# EAGLE design H-bridgeSG3525 (EAGLE 9.6.2)
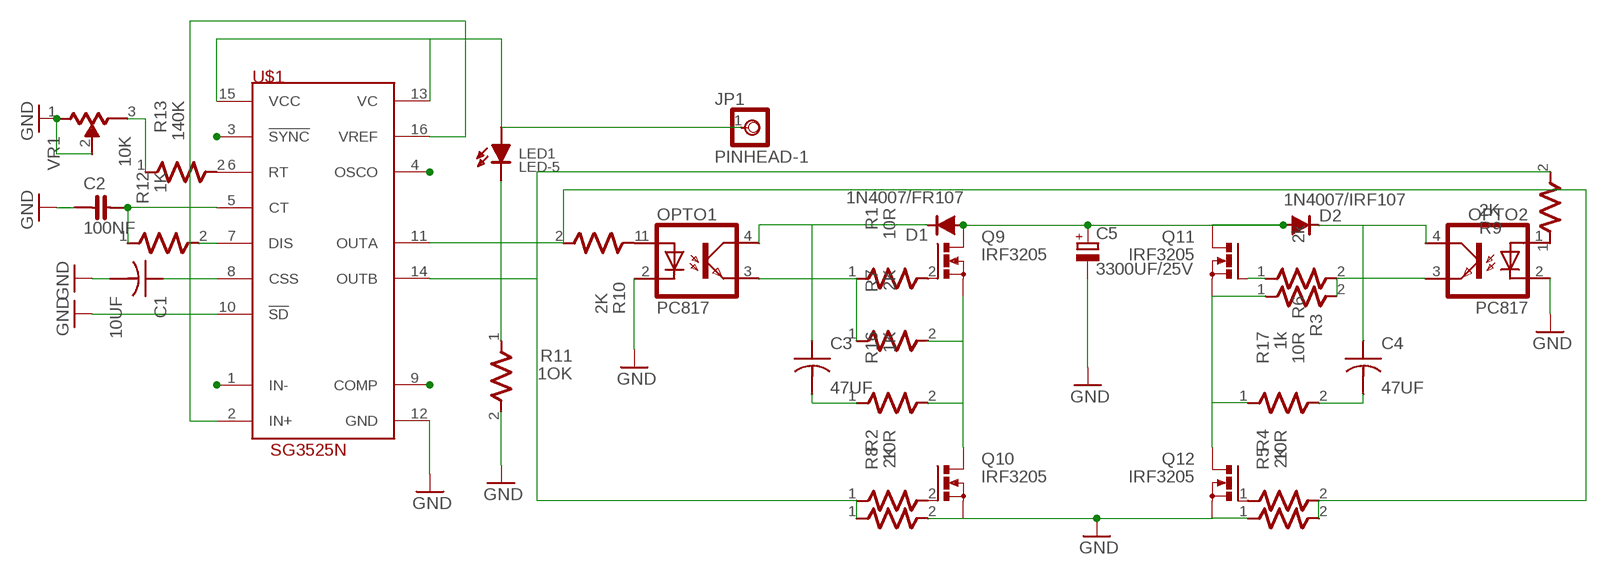
[diagram p0: schematic, sheet 1]

## Parts
C1  10UF  CAP-2,5  [CAP-2,5]
C2  100NF  CAP-NP5  [CAP-NP5]
C3  47UF  CAP-2,5  [CAP-2,5]
C4  47UF  CAP-2,5  [CAP-2,5]
C5  3300UF/25V  CPOL-EUE7.5-18  [E7,5-18]
D1  1N4007/FR107  1N4007  [1N4007]
D2  1N4007/IRF107  1N4007  [1N4007]
JP1  PINHEAD-1  [PINHEAD-1]
LED1  LED-5  [LED5]
OPTO1  PC817  [DIL-04]
OPTO2  PC817  [DIL-04]
Q9  IRF3205  IRF512  [TO220BV]
Q10  IRF3205  IRF512  [TO220BV]
Q11  IRF3205  IRF512  [TO220BV]
Q12  IRF3205  IRF512  [TO220BV]
R1  10R  R-7,5  [R-7,5]
R2  10R  R-7,5  [R-7,5]
R3  10R  R-7,5  [R-7,5]
R4  10R  R-7,5  [R-7,5]
R5  2K  R-7,5  [R-7,5]
R6  2k  R-7,5  [R-7,5]
R7  2K  R-7,5  [R-7,5]
R8  2K  R-7,5  [R-7,5]
R9  2K  R-7,5  [R-7,5]
R10  2K  R-7,5  [R-7,5]
R11  1OK  R-7,5  [R-7,5]
R12  1K  R-7,5  [R-7,5]
R13  140K  R-7,5  [R-7,5]
R16  1K  R-7,5  [R-7,5]
R17  1k  R-7,5  [R-7,5]
U$1  SG3525N  [DIL16]
VR1  10K  VR-5  [VR-5]

## Nets
12V: C5.+ D1.A D2.A Q9.D Q11.D
COMP: U$1.9(COMP)
CSS: C1.+ U$1.8(CSS)
GND: C1.- C2.1 C5.- OPTO1.2(C) OPTO2.2(C) Q10.S Q12.S R5.1 R8.2 R11.2 U$1.10(!SD) U$1.12(GND) VR1.1 VR1.2
IN-: U$1.1(IN-)
N$1: Q9.S Q10.D R7.2 R16.2
N$2: C3.+ D1.K OPTO1.4(COL)
N$3: C4.+ D2.K OPTO2.4(COL)
N$4: OPTO1.3(EMI) R1.1 R7.1
N$5: OPTO2.3(EMI) R3.2 R6.2
N$6: OPTO2.1(A) R9.1
N$8: R13.1 VR1.3
N$9: OPTO1.1(A) R10.1
N$10: LED1.K R11.1
N$11: C3.- R16.1
N$12: R12.2 U$1.7(DIS)
N$13: C4.- R17.2
N$16: R13.2 U$1.6(RT)
N$17: Q11.S Q12.D R6.1 R17.1
N$19: Q9.G R1.2
N$20: Q10.G R2.2
N$21: Q11.G R3.1
N$22: Q12.G R4.1
N$23: U$1.3(!SYNC)
N$24: U$1.4(OSCO)
N$25: C2.2 R12.1 U$1.5(CT)
OUTA: R4.2 R5.2 R10.2 U$1.11(OUTA)
OUTB: R2.1 R8.1 R9.2 U$1.14(OUTB)
VCC: JP1.1 LED1.A U$1.13(VC) U$1.15(VCC)
VREF: U$1.2(IN+) U$1.16(VREF)

## Library data of the parts
C1 C3 C4 = chuong:CAP-2,5
C2 = chuong:CAP-NP5
C5 = lbr:CPOL-EU: POLARIZED CAPACITOR, European symbol
D1 D2 = lbr:1N4007
JP1 = chuong:PINHEAD-1
LED1 = chuong:LED-5
OPTO1 OPTO2 = chuong:PC817
Q9-Q12 = lbr:IRF512: N-CHANNEL MOS FET
R1-R8 R16 R17 = lbr:R-7,5
R9-R13 = chuong:R-7,5
U$1 = irs:SG3525
VR1 = chuong:VR-5

## Board
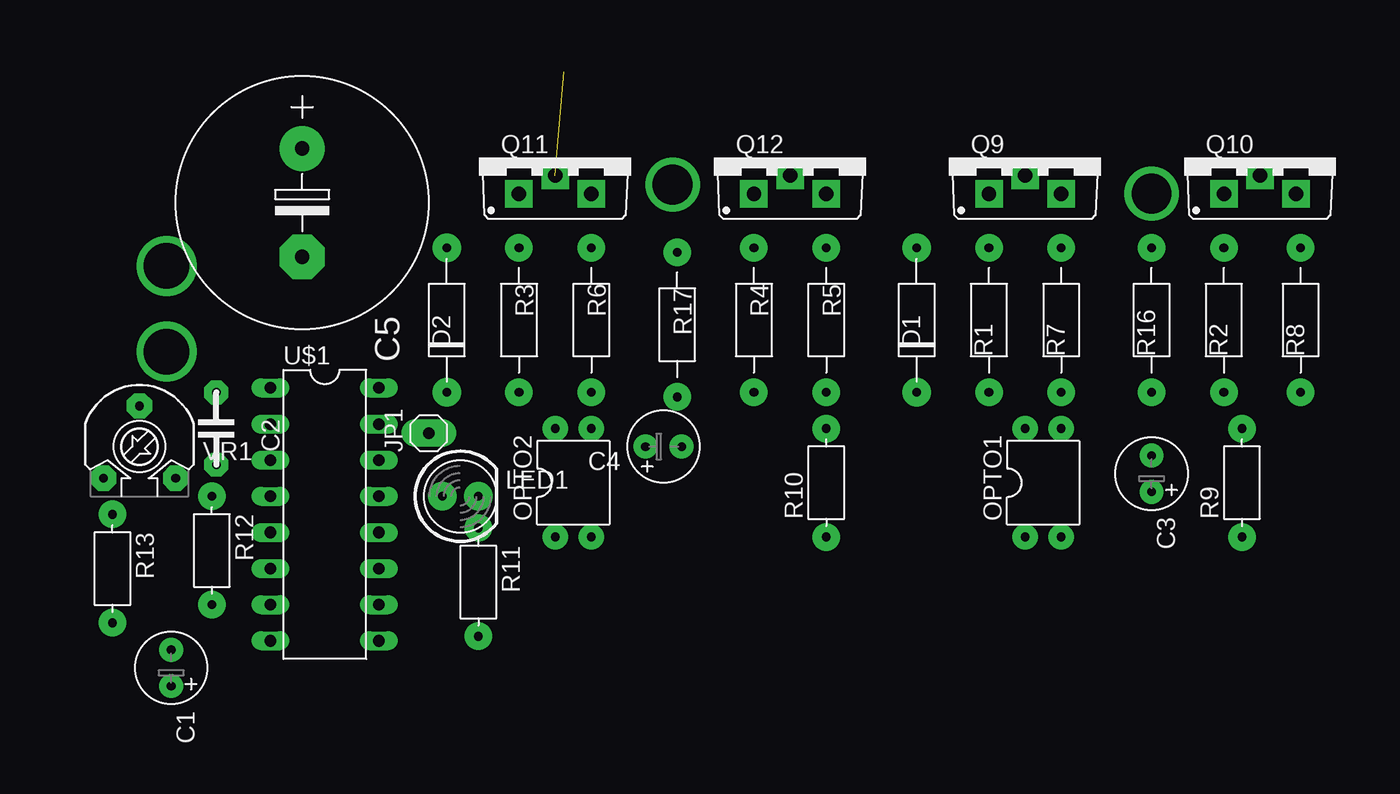
[diagram p1: board, top side]
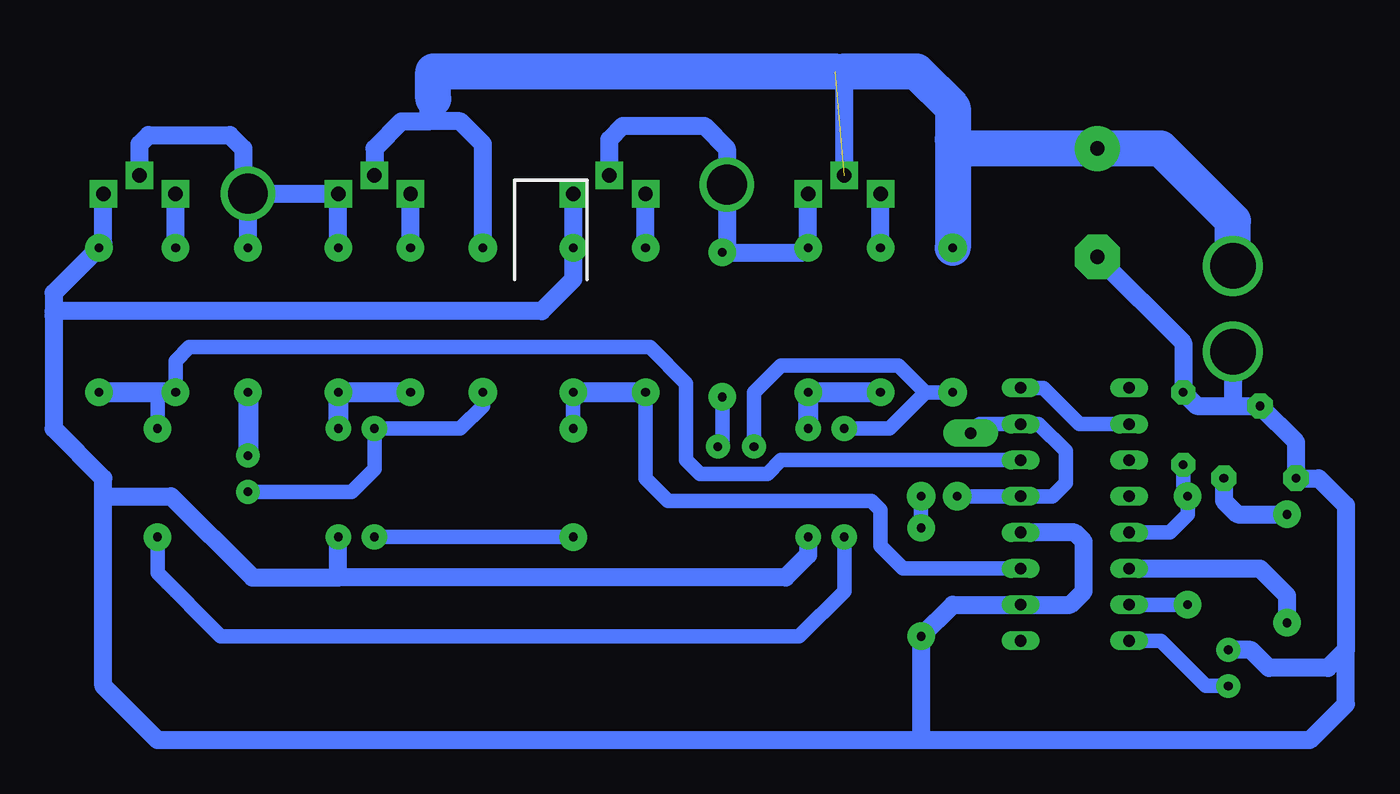
[diagram p2: board, bottom side, seen from below]

No outline drawn. Coordinates in mm, seen from the top.
Copper layers (1*16): Top 0.035mm / dielectric 1.5mm / Bottom 0.035mm
Design rules "default": minimum track width 10mil, minimum drill 24mil, track to track 8mil, track to pad 8mil, pad to pad 8mil, via to via 8mil, smd to smd 8mil, copper to edge 40mil, drill to drill 8mil, minimum pad ring 10mil, minimum via ring 8mil, stop-mask expansion 4mil, vias tented up to drill 0mil, thermal gap 10mil

### Footprints (pad centres in the part's own frame; a part is rotated, then mirrored left to right if it is on the bottom)
CAP-2,5 = drill 0.61 pad 1.676: + 1.27,0; - -1.27,0
CAP-NP5 = drill 0.61 pad 1.676 octagon: 1 -3.81,0; 2 1.27,0
E7,5-18 = drill 1.016 pad 3.15: + -3.81,0 | drill 1.016 pad 3.15 octagon: - 3.81,0
1N4007 = drill 0.61 pad 2: A 5.08,0; K -5.08,0
PINHEAD-1 = drill 0.813 pad 1.93 long: 1 -1.27,0
LED5 = drill 0.61 pad 2: A -1.27,0; K 1.27,0
DIL-04 = drill 0.61 pad 1.778: 1 -1.27,-3.81; 2 1.27,-3.81; 3 1.27,3.81; 4 -1.27,3.81
TO220BV = drill 1.016 pad 1.93 square: D 0,-1.27; G -2.54,-2.54; S 2.54,-2.54
R-7,5 = drill 0.61 pad 1.93: 1 -5.08,0; 2 5.08,0
R-7,5' = drill 0.61 pad 1.93: 1 -3.81,0; 2 3.81,0
DIL16 = drill 0.813 long: 1 -8.89,-3.81; 2 -6.35,-3.81; 3 -3.81,-3.81; 4 -1.27,-3.81; 5 1.27,-3.81; 6 3.81,-3.81; 7 6.35,-3.81; 8 8.89,-3.81; 9 8.89,3.81; 10 6.35,3.81; 11 3.81,3.81; 12 1.27,3.81; 13 -1.27,3.81; 14 -3.81,3.81; 15 -6.35,3.81; 16 -8.89,3.81
VR-5 = drill 0.61 pad 1.778 octagon: 1 -2.54,-2.54; 2 0,2.54; 3 2.54,-2.54

### Placement (x,y rotation side)
C1  16.19,46.67 270 top
C2  19.37,62.23 270 top
C3  85.09,60.33 270 top
C4  50.8,62.23 180 top
C5  25.4,79.38 270 top
D1  68.58,71.12 90 top
D2  35.56,71.12 90 top
JP1  34.29,64.45 90 top
LED1  36.51,58.74 0 top
OPTO1  77.47,59.69 0 top
OPTO2  44.45,59.69 0 top
Q9  76.2,82.55 0 top
Q10  92.71,82.55 0 top
Q11  43.18,82.55 0 top
Q12  59.69,82.55 0 top
R1  73.66,71.12 90 top
R2  90.17,71.12 90 top
R3  40.64,71.12 270 top
R4  57.15,71.12 270 top
R5  62.23,71.12 270 top
R6  45.72,71.12 270 top
R7  78.74,71.12 90 top
R8  95.57,71.12 90 top
R9  2K  [R-7,5']  91.44,59.69 90 top
R10  2K  [R-7,5']  62.23,59.69 90 top
R11  1OK  [R-7,5']  37.78,52.7 270 top
R12  1K  [R-7,5']  19.05,54.93 270 top
R13  140K  [R-7,5']  12.06,53.66 270 top
R16  85.09,71.12 90 top
R17  51.75,70.8 270 top
U$1  26.99,57.47 270 top
VR1  13.97,62.55 0 top

### Tracks (layer width: path | path; a pad name or v marks a point on that pad's centre or on a via)
12V  (via drill 3.2 pad 3.81)  (1 unrouted)
  Bottom 1.27: D1.A 68.58,83.5 70.17,85.09 72.39,85.09 | 72.39,85.09 74.3,85.09 76.2,83.19 Q9.D | Q11.D 43.18,88.58 | 72.39,85.09 72.39,86.36 72.07,86.68
  Bottom 2.54: v15.88,74.93 15.88,78.11 20.95,83.19 C5.+ 34.92,83.19 35.56,83.82 | 35.56,83.82 35.56,86.04 38.1,88.58 43.18,88.58 | 35.56,83.82 D2.A | 43.81,88.58 72.07,88.58 72.07,86.68
CSS
  Bottom 1.016: U$1.8 20.95,48.58 17.78,45.4 C1.+
GND  (via drill 3.2 pad 3.81)
  Bottom 1.27: 16.19,65.09 18.41,65.09 C2.1 19.37,69.53 C5.- | 16.19,65.09 VR1.2 11.43,62.55 VR1.1 9.84,60.01 7.94,58.1 7.94,47.94 | v15.88,68.9 15.88,65.41 16.19,65.09 | 7.94,47.94 9.21,46.67 13.34,46.67 14.61,47.94 C1.- | U$1.12 26.99,56.2 26.35,55.56 26.35,52.07 27.3,51.12 U$1.10 35.56,51.12 R11.2 37.78,41.59 | 37.78,41.59 10.48,41.59 7.94,44.13 7.94,47.94 | OPTO2.2 45.72,54.61 47.31,53.02 78.74,53.02 | 78.74,53.02 OPTO1.2 | 37.78,41.59 91.44,41.59 95.25,45.4 95.25,58.74 | 95.25,58.74 95.25,60.01 98.74,63.5 98.74,71.44 | 95.25,58.74 90.49,58.74 84.77,53.02 78.74,53.02 | Q10.S 95.25,76.52 R8.2 98.74,73.03 98.74,71.75 64.45,71.75 62.23,73.98 R5.1 Q12.S
N$1  (via drill 2.8 pad 3.81)
  Bottom 1.27: R7.2 Q9.S v85.09,80.01 | R16.2 v85.09,80.01 | Q10.D 92.71,83.5 92.08,84.14 86.36,84.14 85.41,83.19 85.41,80.33 v85.09,80.01
N$2
  Bottom 1.016: D1.K 68.58,65.09 70.17,63.5 OPTO1.4 76.2,60.64 77.79,59.05 C3.+
N$3
  Bottom 1.016: D2.K 37.47,66.04 | 37.47,66.04 40.01,63.5 OPTO2.4 | C4.+ 49.53,66.04 47.62,67.94 39.37,67.94 37.47,66.04
N$4
  Bottom 1.422: R1.1 R7.1 OPTO1.3
N$5
  Bottom 1.422: R3.2 R6.2 OPTO2.3
N$6
  Bottom 1.016: OPTO2.1 43.18,52.07 46.35,48.9 87,48.9 91.44,53.34 R9.1
N$8
  Bottom 1.27: VR1.3 16.51,58.42 15.56,57.47 R13.1
N$9
  Bottom 1.016: R10.1 OPTO1.1
N$10
  Bottom 1.016: LED1.K R11.1
N$11
  Bottom 1.422: R16.1 C3.-
N$12
  Bottom 1.016: R12.2 U$1.7
N$13
  Bottom 1.016: R17.2 51.75,62.55 C4.-
N$16
  Bottom 1.27: U$1.6 13.97,53.66 12.06,51.75 R13.2
N$17  (via drill 2.8 pad 3.81)
  Bottom 1.27: Q11.S R6.1 46.04,75.88 R17.1 51.44,76.2 v51.44,80.64 51.44,83.19 53.02,84.77 58.74,84.77 59.69,83.82 Q12.D
N$19
  Bottom 1.27: R1.2 Q9.G
N$20
  Bottom 1.27: R2.2 Q10.G
N$21
  Bottom 1.27: R3.1 Q11.G
N$22
  Bottom 1.27: R4.1 Q12.G
N$25
  Bottom 1.016: C2.2 19.37,59.05 R12.1 19.05,57.47 20.32,56.2 U$1.5
OUTA
  Bottom 1.016: R5.2 R10.2 | U$1.11 39.05,53.66 40.64,55.24 40.64,57.78 41.27,58.42 55.56,58.42 57.15,60.01 R4.2
  Bottom 1.422: R4.2 R5.2
OUTB
  Bottom 1.016: R9.2 91.44,65.72 91.12,66.04 R2.1 90.17,68.26 89.22,69.22 56.83,69.22 54.29,66.67 54.29,61.28 53.34,60.33 48.58,60.33 47.62,61.28 U$1.14
  Bottom 1.422: R2.1 R8.1
VCC
  Bottom 1.016: JP1.1 33.66,63.82 U$1.15 29.53,63.82 27.62,61.91 27.62,59.69 28.57,58.74 U$1.13 LED1.A
VREF
  Bottom 1.016: U$1.16 29.21,66.36 26.67,63.82 U$1.2